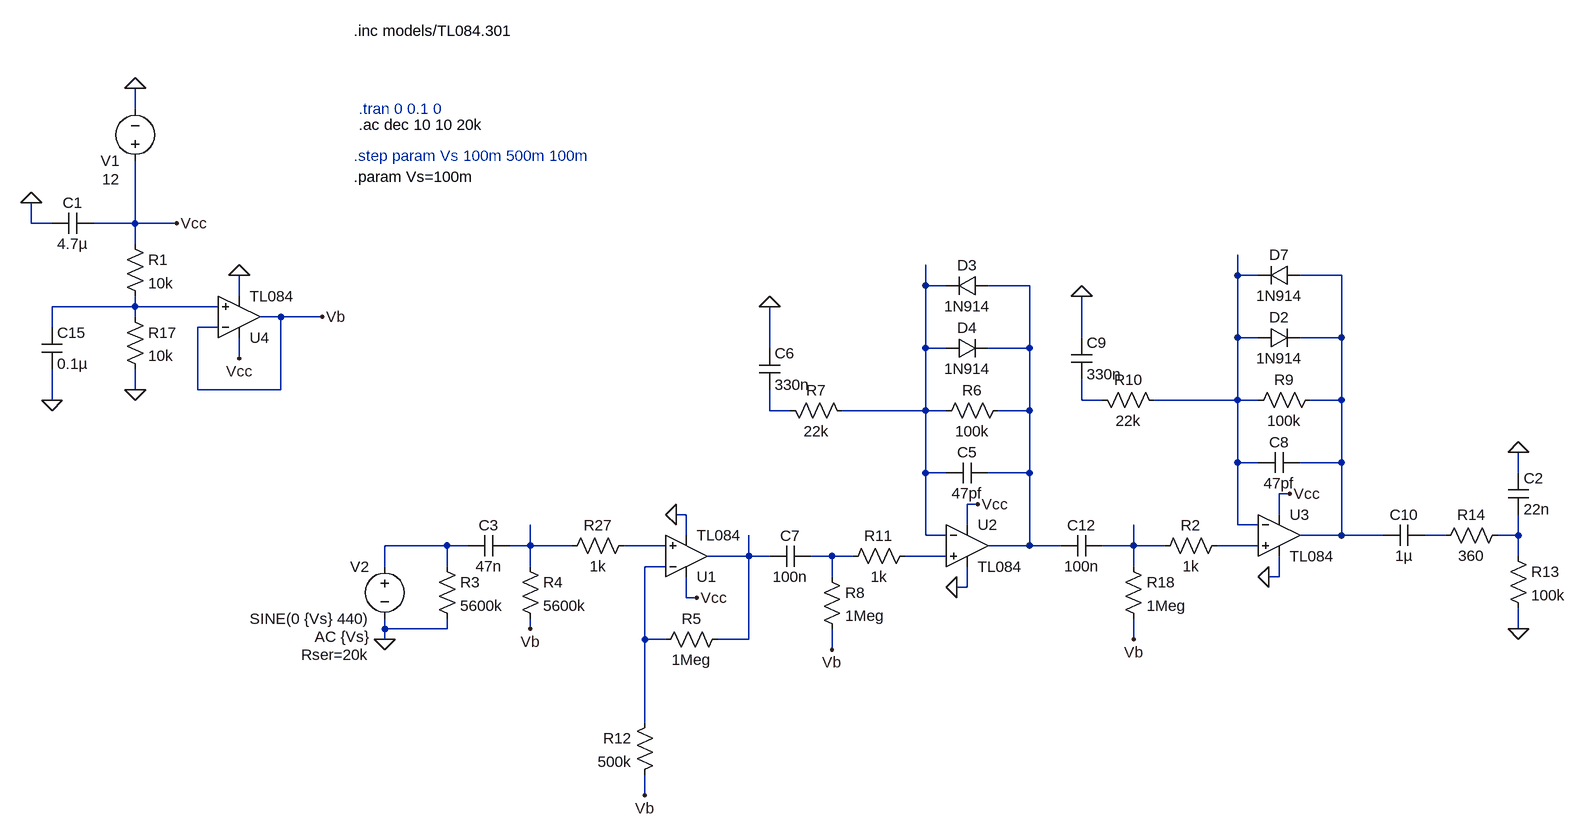
[diagram p0: schematic muff fuzz 21-05-20 no tone ctrl op half vcc ref.asc]
muff fuzz 21-05-20 no tone ctrl op half vcc ref.asc, the LTspice schematic file:
Version 4
SHEET 1 3092 1052
WIRE 80 -480 80 -512
WIRE -80 -304 -80 -336
WIRE -48 -304 -80 -304
WIRE 80 -304 80 -400
WIRE 80 -304 16 -304
WIRE 144 -304 80 -304
WIRE 80 -272 80 -304
WIRE 1776 -224 1776 -256
WIRE 1808 -224 1776 -224
WIRE 1936 -224 1872 -224
WIRE 1296 -208 1296 -240
WIRE 1328 -208 1296 -208
WIRE 1456 -208 1392 -208
WIRE 240 -192 240 -224
WIRE 80 -176 80 -192
WIRE 80 -176 -48 -176
WIRE 208 -176 80 -176
WIRE 80 -160 80 -176
WIRE 304 -160 272 -160
WIRE 368 -160 304 -160
WIRE -48 -144 -48 -176
WIRE 208 -144 176 -144
WIRE 1536 -128 1536 -192
WIRE 1776 -128 1776 -224
WIRE 1808 -128 1776 -128
WIRE 1936 -128 1936 -224
WIRE 1936 -128 1872 -128
WIRE 1056 -112 1056 -176
WIRE 1296 -112 1296 -208
WIRE 1328 -112 1296 -112
WIRE 1456 -112 1456 -208
WIRE 1456 -112 1392 -112
WIRE 240 -96 240 -128
WIRE 80 -48 80 -80
WIRE 176 -48 176 -144
WIRE 304 -48 304 -160
WIRE 304 -48 176 -48
WIRE -48 -32 -48 -80
WIRE 1536 -32 1536 -64
WIRE 1568 -32 1536 -32
WIRE 1776 -32 1776 -128
WIRE 1776 -32 1648 -32
WIRE 1808 -32 1776 -32
WIRE 1936 -32 1936 -128
WIRE 1936 -32 1888 -32
WIRE 1056 -16 1056 -48
WIRE 1088 -16 1056 -16
WIRE 1296 -16 1296 -112
WIRE 1296 -16 1168 -16
WIRE 1328 -16 1296 -16
WIRE 1456 -16 1456 -112
WIRE 1456 -16 1408 -16
WIRE 1776 64 1776 -32
WIRE 1808 64 1776 64
WIRE 1936 64 1936 -32
WIRE 1936 64 1872 64
WIRE 1296 80 1296 -16
WIRE 1328 80 1296 80
WIRE 1456 80 1456 -16
WIRE 1456 80 1392 80
WIRE 2208 80 2208 48
WIRE 1856 112 1840 112
WIRE 1376 128 1360 128
WIRE 928 144 912 144
WIRE 1840 144 1840 112
WIRE 1360 160 1360 128
WIRE 1776 160 1776 64
WIRE 1808 160 1776 160
WIRE 928 176 928 144
WIRE 1296 176 1296 80
WIRE 1328 176 1296 176
WIRE 1936 176 1936 64
WIRE 1936 176 1872 176
WIRE 2000 176 1936 176
WIRE 2096 176 2064 176
WIRE 2208 176 2208 144
WIRE 2208 176 2176 176
WIRE 560 192 464 192
WIRE 592 192 560 192
WIRE 688 192 688 160
WIRE 688 192 656 192
WIRE 752 192 688 192
WIRE 896 192 832 192
WIRE 1456 192 1456 80
WIRE 1456 192 1392 192
WIRE 1504 192 1456 192
WIRE 1616 192 1616 160
WIRE 1616 192 1568 192
WIRE 1664 192 1616 192
WIRE 1808 192 1744 192
WIRE 1024 208 1024 176
WIRE 1024 208 960 208
WIRE 1056 208 1024 208
WIRE 1152 208 1120 208
WIRE 1184 208 1152 208
WIRE 1328 208 1264 208
WIRE 2208 208 2208 176
WIRE 464 224 464 192
WIRE 560 224 560 192
WIRE 688 224 688 192
WIRE 896 224 864 224
WIRE 1616 224 1616 192
WIRE 1152 240 1152 208
WIRE 1840 240 1840 208
WIRE 1840 240 1824 240
WIRE 1360 256 1360 224
WIRE 1360 256 1344 256
WIRE 928 272 928 240
WIRE 944 272 928 272
WIRE 464 320 464 304
WIRE 560 320 560 304
WIRE 560 320 464 320
WIRE 688 320 688 304
WIRE 2208 320 2208 288
WIRE 464 336 464 320
WIRE 864 336 864 224
WIRE 896 336 864 336
WIRE 1024 336 1024 208
WIRE 1024 336 976 336
WIRE 1616 336 1616 304
WIRE 1152 352 1152 320
WIRE 864 464 864 336
WIRE 864 576 864 544
FLAG 144 -304 Vcc
FLAG 464 336 0
FLAG 368 -160 Vb
FLAG 80 -512 0
FLAG 688 320 Vb
FLAG 1344 256 0
FLAG 1376 128 Vcc
FLAG 944 272 Vcc
FLAG 912 144 0
FLAG 1856 112 Vcc
FLAG 1824 240 0
FLAG 1152 352 Vb
FLAG 1616 336 Vb
FLAG -80 -336 0
FLAG 240 -224 0
FLAG 240 -96 Vcc
FLAG 2208 320 0
FLAG -48 -32 0
FLAG 80 -48 0
FLAG 1056 -176 0
FLAG 1536 -192 0
FLAG 864 576 Vb
FLAG 2208 48 0
DATAFLAG 688 160 ""
DATAFLAG 1616 160 ""
DATAFLAG 1296 -240 ""
DATAFLAG 1776 -256 ""
DATAFLAG 1024 176 ""
SYMBOL voltage 80 -384 R180
WINDOW 123 24 -12 Left 2
WINDOW 39 24 -12 Left 2
WINDOW 3 24 -12 Left 2
SYMATTR Value 12
SYMATTR InstName V1
SYMBOL res 64 -288 R0
SYMATTR InstName R1
SYMATTR Value 10k
SYMBOL Opamps\\opamp2 928 272 M180
SYMATTR InstName U1
SYMATTR Value TL084
SYMBOL voltage 464 208 M0
WINDOW 123 24 124 Left 2
WINDOW 39 24 152 Left 2
SYMATTR Value2 AC {Vs}
SYMATTR SpiceLine Rser=20k
SYMATTR InstName V2
SYMATTR Value SINE(0 {Vs} 440)
SYMBOL res 544 208 R0
SYMATTR InstName R3
SYMATTR Value 5600k
SYMBOL cap 656 176 R90
WINDOW 0 0 32 VBottom 2
WINDOW 3 32 32 VTop 2
SYMATTR InstName C3
SYMATTR Value 47n
SYMBOL res 672 208 R0
SYMATTR InstName R4
SYMATTR Value 5600k
SYMBOL Opamps\\opamp2 1360 128 R0
SYMATTR InstName U2
SYMATTR Value TL084
SYMBOL res 1312 0 R270
WINDOW 0 32 56 VTop 2
WINDOW 3 0 56 VBottom 2
SYMATTR InstName R6
SYMATTR Value 100k
SYMBOL res 1072 -32 M90
WINDOW 0 0 56 VBottom 2
WINDOW 3 32 56 VTop 2
SYMATTR InstName R7
SYMATTR Value 22k
SYMBOL cap 1040 -48 M180
WINDOW 0 24 56 Left 2
WINDOW 3 24 8 Left 2
SYMATTR InstName C6
SYMATTR Value 330n
SYMATTR SpiceLine V=10 Irms=0 Rser=0 Lser=0
SYMBOL res 1136 224 R0
SYMATTR InstName R8
SYMATTR Value 1Meg
SYMBOL diode 1392 -192 M270
WINDOW 0 32 32 VTop 2
WINDOW 3 0 32 VBottom 2
SYMATTR InstName D3
SYMATTR Value 1N914
SYMBOL diode 1328 -128 M90
WINDOW 0 0 32 VBottom 2
WINDOW 3 32 32 VTop 2
SYMATTR InstName D4
SYMATTR Value 1N914
SYMBOL Opamps\\opamp2 1840 112 R0
SYMATTR InstName U3
SYMATTR Value TL084
SYMBOL res 1792 -16 R270
WINDOW 0 32 56 VTop 2
WINDOW 3 0 56 VBottom 2
SYMATTR InstName R9
SYMATTR Value 100k
SYMBOL cap 1872 48 R90
WINDOW 0 0 32 VBottom 2
WINDOW 3 32 32 VTop 2
SYMATTR InstName C8
SYMATTR Value 47pf
SYMBOL diode 1872 -208 M270
WINDOW 0 32 32 VTop 2
WINDOW 3 0 32 VBottom 2
SYMATTR InstName D7
SYMATTR Value 1N914
SYMBOL res 1552 -48 M90
WINDOW 0 0 56 VBottom 2
WINDOW 3 32 56 VTop 2
SYMATTR InstName R10
SYMATTR Value 22k
SYMBOL cap 2064 160 R90
WINDOW 0 0 32 VBottom 2
WINDOW 3 32 32 VTop 2
SYMATTR InstName C10
SYMATTR Value 1µ
SYMBOL res 1600 208 R0
SYMATTR InstName R18
SYMATTR Value 1Meg
SYMBOL res 992 320 R90
WINDOW 0 0 56 VBottom 2
WINDOW 3 32 56 VTop 2
SYMATTR InstName R5
SYMATTR Value 1Meg
SYMBOL cap 16 -320 R90
WINDOW 0 0 32 VBottom 2
WINDOW 3 32 32 VTop 2
SYMATTR InstName C1
SYMATTR Value 4.7µ
SYMBOL diode 1808 -112 R270
WINDOW 0 32 32 VTop 2
WINDOW 3 0 32 VBottom 2
SYMATTR InstName D2
SYMATTR Value 1N914
SYMBOL res 848 176 R90
WINDOW 0 0 56 VBottom 2
WINDOW 3 32 56 VTop 2
SYMATTR InstName R27
SYMATTR Value 1k
SYMBOL Opamps\\opamp2 240 -96 M180
SYMATTR InstName U4
SYMATTR Value TL084
SYMBOL res 2192 192 R0
SYMATTR InstName R13
SYMATTR Value 100k
SYMBOL res 2192 160 R90
WINDOW 0 0 56 VBottom 2
WINDOW 3 32 56 VTop 2
SYMATTR InstName R14
SYMATTR Value 360
SYMBOL cap -64 -144 R0
SYMATTR InstName C15
SYMATTR Value 0.1µ
SYMBOL cap 1392 64 R90
WINDOW 0 0 32 VBottom 2
WINDOW 3 32 32 VTop 2
SYMATTR InstName C5
SYMATTR Value 47pf
SYMBOL cap 1520 -64 M180
WINDOW 0 24 56 Left 2
WINDOW 3 24 8 Left 2
SYMATTR InstName C9
SYMATTR Value 330n
SYMATTR SpiceLine V=10 Irms=0 Rser=0 Lser=0
SYMBOL res 64 -176 R0
SYMATTR InstName R17
SYMATTR Value 10k
SYMBOL cap 1120 192 R90
WINDOW 0 0 32 VBottom 2
WINDOW 3 32 32 VTop 2
SYMATTR InstName C7
SYMATTR Value 100n
SYMBOL res 1280 192 R90
WINDOW 0 0 56 VBottom 2
WINDOW 3 32 56 VTop 2
SYMATTR InstName R11
SYMATTR Value 1k
SYMBOL cap 1568 176 R90
WINDOW 0 0 32 VBottom 2
WINDOW 3 32 32 VTop 2
SYMATTR InstName C12
SYMATTR Value 100n
SYMBOL res 1760 176 R90
WINDOW 0 0 56 VBottom 2
WINDOW 3 32 56 VTop 2
SYMATTR InstName R2
SYMATTR Value 1k
SYMBOL res 880 448 M0
SYMATTR InstName R12
SYMATTR Value 500k
SYMBOL cap 2192 80 R0
SYMATTR InstName C2
SYMATTR Value 22n
TEXT 424 -480 Left 2 ;.tran 0 0.1 0
TEXT 424 -456 Left 2 !.ac dec 10 10 20k
TEXT 416 -600 Left 2 !.inc models/TL084.301
TEXT 416 -408 Left 2 ;.step param Vs 100m 500m 100m
TEXT 416 -376 Left 2 !.param Vs=100m

The netlist it stands for:
* muff fuzz 21-05-20 no tone ctrl op half vcc ref.asc
V1 Vcc 0 12
R1 Vcc N005 10k
XU1 N012 N018 Vcc 0 N015 TL084  ; pins In+ In- V+ V- OUT
V2 N010 0 SINE(0 {Vs} 440) AC {Vs} Rser=20k
R3 N010 0 5600k
C3 N011 N010 47n
R4 N011 Vb 5600k
XU2 N017 N003 Vcc 0 N004 TL084  ; pins In+ In- V+ V- OUT
R6 N003 N004 100k
R7 N007 N003 22k
C6 N007 0 330n V=10 Irms=0 Rser=0 Lser=0
R8 N016 Vb 1Meg
D3 N004 N003 1N914
D4 N003 N004 1N914
XU3 N014 N001 Vcc 0 N002 TL084  ; pins In+ In- V+ V- OUT
R9 N001 N002 100k
C8 N002 N001 47pf
D7 N002 N001 1N914
R10 N006 N001 22k
C10 N008 N002 1µ
R18 N013 Vb 1Meg
R5 N015 N018 1Meg
C1 Vcc 0 4.7µ
D2 N001 N002 1N914
R27 N012 N011 1k
XU4 N005 Vb Vcc 0 Vb TL084  ; pins In+ In- V+ V- OUT
R13 N009 0 100k
R14 N009 N008 360
C15 N005 0 0.1µ
C5 N004 N003 47pf
C9 N006 0 330n V=10 Irms=0 Rser=0 Lser=0
R17 N005 0 10k
C7 N016 N015 100n
R11 N017 N016 1k
C12 N013 N004 100n
R2 N014 N013 1k
R12 N018 Vb 500k
C2 0 N009 22n
.model D D
.lib standard.dio
* .tran 0 0.1 0
.ac dec 10 10 20k
.inc models/TL084.301
* .step param Vs 100m 500m 100m
.param Vs=100m
.backanno
.end